# Altium schematic sheet TILE_DEMUX.SchDoc
size A
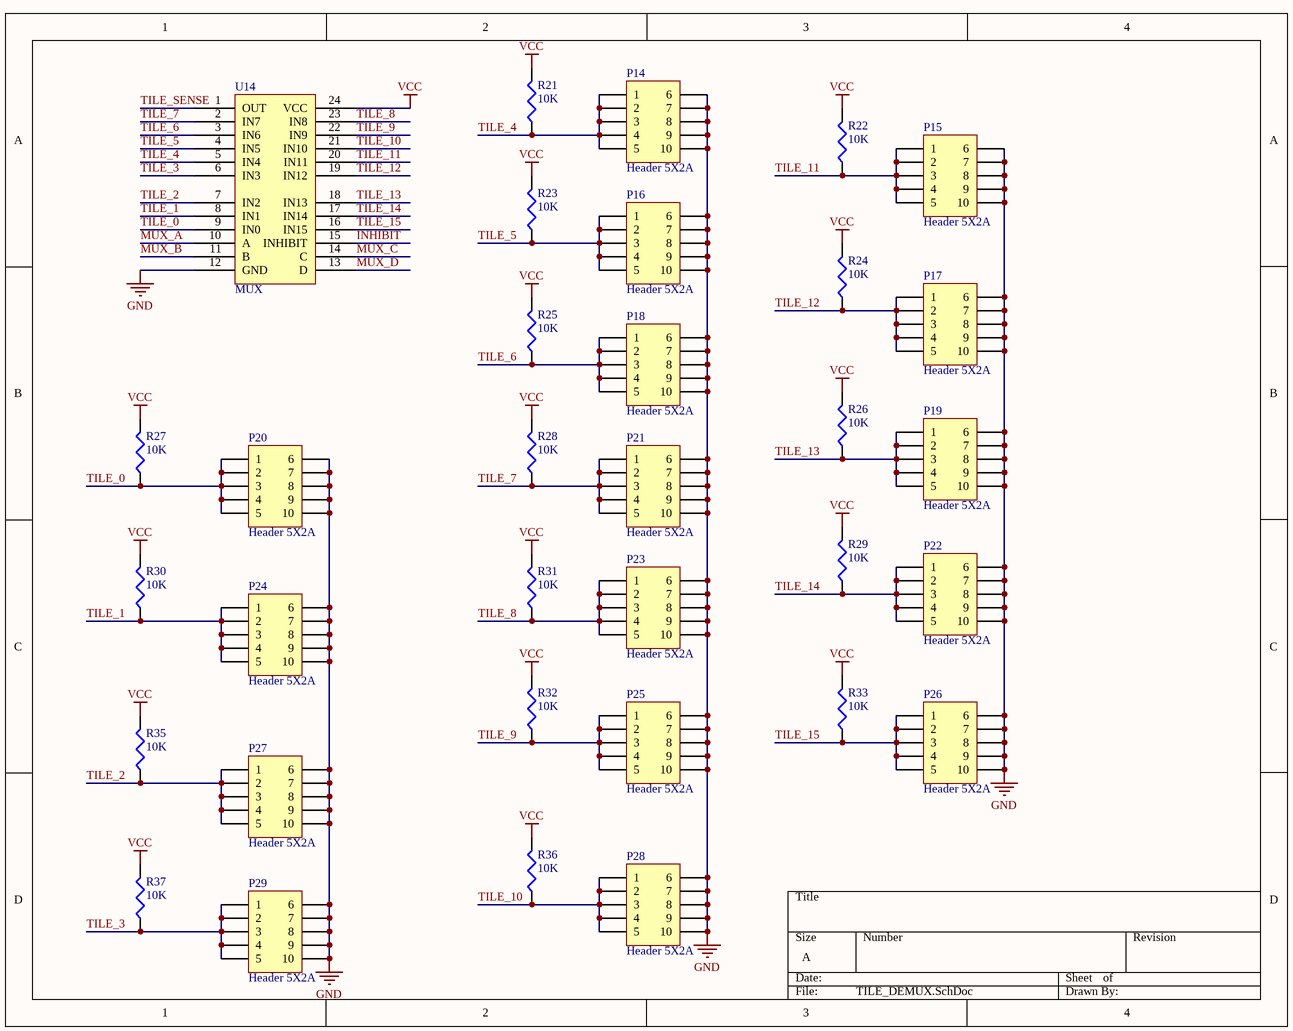
[diagram p0: TILE_DEMUX.SchDoc]

## Parts
P14  Header 5X2A  [HDR2X5_CEN]
P15  Header 5X2A  [HDR2X5_CEN]
P16  Header 5X2A  [HDR2X5_CEN]
P17  Header 5X2A  [HDR2X5_CEN]
P18  Header 5X2A  [HDR2X5_CEN]
P19  Header 5X2A  [HDR2X5_CEN]
P20  Header 5X2A  [HDR2X5_CEN]
P21  Header 5X2A  [HDR2X5_CEN]
P22  Header 5X2A  [HDR2X5_CEN]
P23  Header 5X2A  [HDR2X5_CEN]
P24  Header 5X2A  [HDR2X5_CEN]
P25  Header 5X2A  [HDR2X5_CEN]
P26  Header 5X2A  [HDR2X5_CEN]
P27  Header 5X2A  [HDR2X5_CEN]
P28  Header 5X2A  [HDR2X5_CEN]
P29  Header 5X2A  [HDR2X5_CEN]
R21  value 10K  [RESC1608L]  (hidden comment: Res3)
R22  value 10K  [RESC1608L]  (hidden comment: Res3)
R23  value 10K  [RESC1608L]  (hidden comment: Res3)
R24  value 10K  [RESC1608L]  (hidden comment: Res3)
R25  value 10K  [RESC1608L]  (hidden comment: Res3)
R26  value 10K  [RESC1608L]  (hidden comment: Res3)
R27  value 10K  [RESC1608L]  (hidden comment: Res3)
R28  value 10K  [RESC1608L]  (hidden comment: Res3)
R29  value 10K  [RESC1608L]  (hidden comment: Res3)
R30  value 10K  [RESC1608L]  (hidden comment: Res3)
R31  value 10K  [RESC1608L]  (hidden comment: Res3)
R32  value 10K  [RESC1608L]  (hidden comment: Res3)
R33  value 10K  [RESC1608L]  (hidden comment: Res3)
R35  value 10K  [RESC1608L]  (hidden comment: Res3)
R36  value 10K  [RESC1608L]  (hidden comment: Res3)
R37  value 10K  [RESC1608L]  (hidden comment: Res3)
U14  MUX  [SOIC-24MUX]

## Nets
GND: P14.6 P14.7 P14.8 P14.9 P14.10 P15.6 P15.7 P15.8 P15.9 P15.10 P16.6 P16.7 P16.8 P16.9 P16.10 P17.6 P17.7 P17.8 P17.9 P17.10 P18.6 P18.7 P18.8 P18.9 P18.10 P19.6 P19.7 P19.8 P19.9 P19.10 P20.6 P20.7 P20.8 P20.9 P20.10 P21.6 P21.7 P21.8 P21.9 P21.10 P22.6 P22.7 P22.8 P22.9 P22.10 P23.6 P23.7 P23.8 P23.9 P23.10 P24.6 P24.7 P24.8 P24.9 P24.10 P25.6 P25.7 P25.8 P25.9 P25.10 P26.6 P26.7 P26.8 P26.9 P26.10 P27.6 P27.7 P27.8 P27.9 P27.10 P28.6 P28.7 P28.8 P28.9 P28.10 P29.6 P29.7 P29.8 P29.9 P29.10 U14.12(GND)
VCC: R21.2 R22.2 R23.2 R24.2 R25.2 R26.2 R27.2 R28.2 R29.2 R30.2 R31.2 R32.2 R33.2 R35.2 R36.2 R37.2 U14.24(VCC)
INHIBIT: U14.15(INHIBIT)
MUX_A: U14.10(A)
MUX_B: U14.11(B)
MUX_C: U14.14(C)
MUX_D: U14.13(D)
TILE_0: P20.1 P20.2 P20.3 P20.4 P20.5 R27.1 U14.9(IN0)
TILE_1: P24.1 P24.2 P24.3 P24.4 P24.5 R30.1 U14.8(IN1)
TILE_2: P27.1 P27.2 P27.3 P27.4 P27.5 R35.1 U14.7(IN2)
TILE_3: P29.1 P29.2 P29.3 P29.4 P29.5 R37.1 U14.6(IN3)
TILE_4: P14.1 P14.2 P14.3 P14.4 P14.5 R21.1 U14.5(IN4)
TILE_5: P16.1 P16.2 P16.3 P16.4 P16.5 R23.1 U14.4(IN5)
TILE_6: P18.1 P18.2 P18.3 P18.4 P18.5 R25.1 U14.3(IN6)
TILE_7: P21.1 P21.2 P21.3 P21.4 P21.5 R28.1 U14.2(IN7)
TILE_8: P23.1 P23.2 P23.3 P23.4 P23.5 R31.1 U14.23(IN8)
TILE_9: P25.1 P25.2 P25.3 P25.4 P25.5 R32.1 U14.22(IN9)
TILE_10: P28.1 P28.2 P28.3 P28.4 P28.5 R36.1 U14.21(IN10)
TILE_11: P15.1 P15.2 P15.3 P15.4 P15.5 R22.1 U14.20(IN11)
TILE_12: P17.1 P17.2 P17.3 P17.4 P17.5 R24.1 U14.19(IN12)
TILE_13: P19.1 P19.2 P19.3 P19.4 P19.5 R26.1 U14.18(IN13)
TILE_14: P22.1 P22.2 P22.3 P22.4 P22.5 R29.1 U14.17(IN14)
TILE_15: P26.1 P26.2 P26.3 P26.4 P26.5 R33.1 U14.16(IN15)
TILE_SENSE: U14.1(OUT)

## Library data of the parts
P14-P29 = Header 5X2A: Header, 5-Pin, Dual row; LatestRevisionDate: 17-Jul-2002; LatestRevisionNote: Re-released for DXP Platform.; Publisher: Altium Limited
R21-R33 R35-R37 = Res3: Resistor; Published: 8-Jun-2000; LatestRevisionDate: 29-May-2009; LatestRevisionNote: IPC-7351 Footprint Added.; PackageReference: J1-0603; Publisher: Altium Limited; PackageDescription: Chip Resistor